# EAGLE design 808-Maraca (EAGLE 7.1.0)
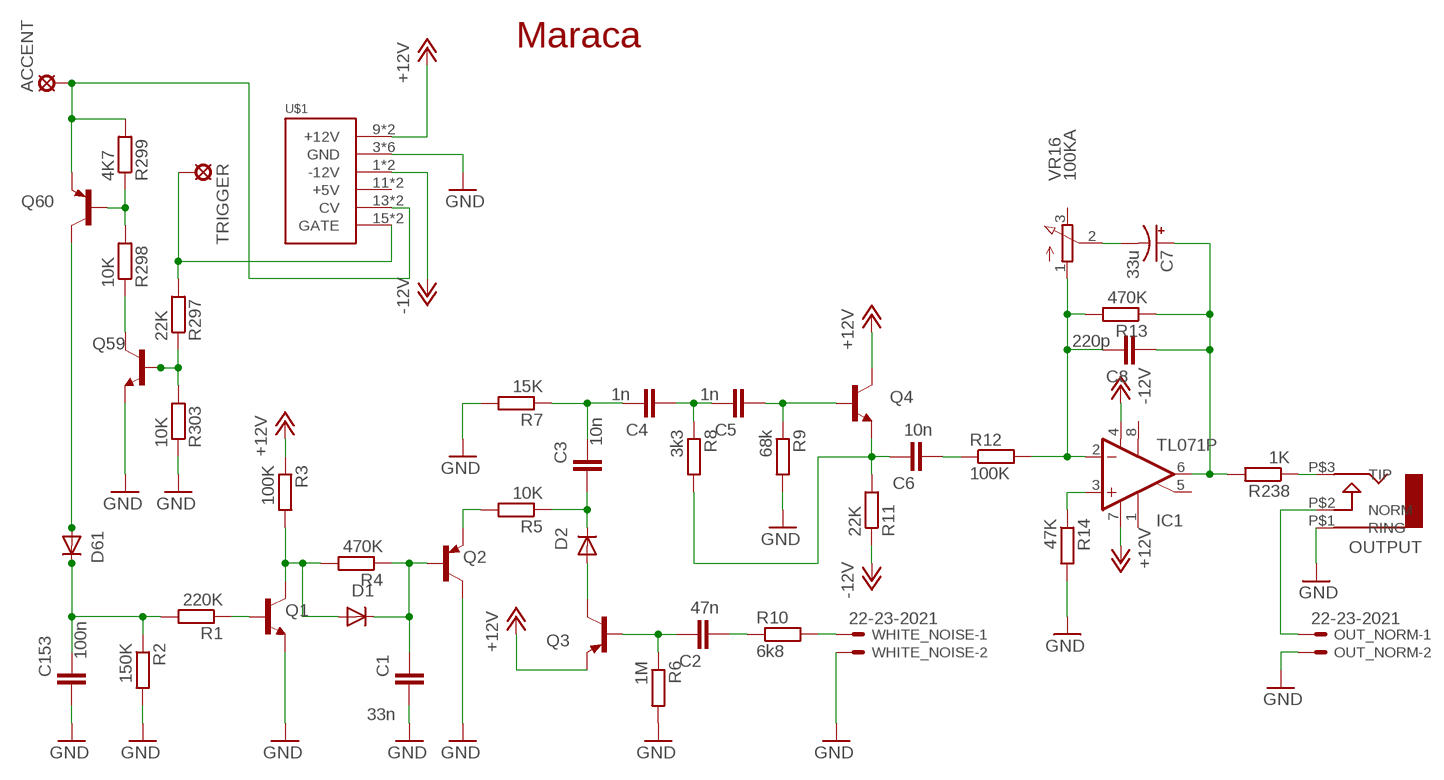
[diagram p0: schematic, sheet 1]

## Parts
ACCENT  LSP11  [LSP11]
C1  33n  C-EU025-025X050  [C025-025X050]
C2  47n  C-EU025-025X050  [C025-025X050]
C3  10n  C-EU025-025X050  [C025-025X050]
C4  1n  C-EU025-025X050  [C025-025X050]
C5  1n  C-EU050-024X044  [C050-024X044]
C6  10n  C-EU025-025X050  [C025-025X050]
C7  33u  CPOL-USB45181A  [B45181A]
C8  220p  C-EU050-024X044  [C050-024X044]
C153  100n  C-EU025-025X050  [C025-025X050]
D1  1N4148DO35-10  [DO35-10]
D2  1N4148DO35-10  [DO35-10]
D61  1N4148DO35-10  [DO35-10]
IC1  TL071P  [DIL08]
OUT_NORM  22-23-2021  [22-23-2021]
OUTPUT  AUDIO-JACK  [ERTHENVAR-JACK-90DEG]
Q1  2N3904  [TO92]
Q2  2N3906  [TO92]
Q3  2N3906  [TO92]
Q4  2N3904  [TO92]
Q59  2N3904  [TO92]
Q60  2N3906  [TO92]
R1  220K  R-EU_0207/7  [0207/7]
R2  150K  R-EU_0207/7  [0207/7]
R3  100K  R-EU_0207/7  [0207/7]
R4  470K  R-EU_0207/7  [0207/7]
R5  10K  R-EU_0207/5V  [0207/5V]
R6  1M  R-EU_0207/5V  [0207/5V]
R7  15K  R-EU_0207/5V  [0207/5V]
R8  3k3  R-EU_0207/5V  [0207/5V]
R9  68k  R-EU_0207/7  [0207/7]
R10  6k8  R-EU_0207/5V  [0207/5V]
R11  22K  R-EU_0309/10  [0309/10]
R12  100K  R-EU_0207/5V  [0207/5V]
R13  470K  R-EU_0207/7  [0207/7]
R14  47K  R-EU_0207/7  [0207/7]
R238  1K  R-EU_0207/5V  [0207/5V]
R297  22K  R-EU_0207/5V  [0207/5V]
R298  10K  R-EU_0207/5V  [0207/5V]
R299  4K7  R-EU_0207/5V  [0207/5V]
R303  10K  R-EU_0207/5V  [0207/5V]
TRIGGER  LSP11  [LSP11]
U$1  POWER  [POWER_16]
VR16  100KA  3RP/1610N  [3RP/1610N]
WHITE_NOISE  22-23-2021  [22-23-2021]

## Nets
+12V: IC1.7(V+) Q3.3(E) Q4.1(C) R3.1 U$1.9(+12V) U$1.10(+12V)
-12V: IC1.4(V-) R11.1 U$1.1(-12V) U$1.2(-12V)
GND [GND]: C1.1 C153.1 OUT_NORM.2 OUTPUT.P$1(RING) Q1.3(E) Q2.1(C) Q59.3(E) R2.2 R6.2 R7.2 R9.2 R14.2 R303.1 U$1.3(GND) U$1.4(GND) U$1.5(GND) U$1.6(GND) U$1.7(GND) U$1.8(GND) WHITE_NOISE.2
LT_LC_OUT: OUTPUT.P$3(TIP) R238.1
N$1: Q60.2(B) R298.2 R299.1
N$2: Q1.2(B) R1.1
N$3: D1.A Q1.1(C) R3.2 R4.2
N$4: C1.2 D1.C Q2.2(B) R4.1
N$5: OUT_NORM.1 OUTPUT.P$2(NORM)
N$6: R10.2 WHITE_NOISE.1
N$7: Q2.3(E) R5.2
N$8: C7.+ C8.1 IC1.6(OUT) R13.1 R238.2
N$9: C3.1 D2.C R5.1
N$10: D2.A Q3.1(C)
N$11: C2.2 Q3.2(B) R6.1
N$12: C3.2 C4.2 R7.1
N$13: C4.1 C5.2 R8.1
N$14: C2.1 R10.1
N$15: C5.1 Q4.2(B) R9.1
N$16: C6.2 Q4.3(E) R8.2 R11.2
N$17: C8.2 IC1.2(-IN) R12.2 R13.2 VR16.1(A)
N$18: C6.1 R12.1
N$19: C7.- VR16.2(S)
N$20: R297.2 TRIGGER.MP U$1.15(GATE) U$1.16(GATE)
N$22: IC1.3(+IN) R14.1
N$318: Q59.2(B) R297.1 R303.2
N$319: Q59.1(C) R298.1
N$324: C153.2 D61.C R1.2 R2.1
N$357: D61.A Q60.1(C)
TRIG: ACCENT.MP Q60.3(E) R299.2 U$1.13(CV) U$1.14(CV)
Unconnected: IC1.1(ON1) IC1.5(ON2) IC1.8(OPT) U$1.11(+5V) U$1.12(+5V) VR16.3(E)

## Notes on the sheet
- Maraca

## Library data of the parts
ACCENT TRIGGER = solpad:LSP11: SOLDER PAD drill 1.1 mm
C1-C6 C8 C153 = TR808clone:C-EU: CAPACITOR, European symbol Pitch 3mm
C7 = rcl:CPOL-US: POLARIZED CAPACITOR, American symbol
D1 D2 D61 = TR808clone:1N4148: DIODE high speed (Philips)
IC1 = linear:TL071: OP AMP
OUT_NORM WHITE_NOISE = con-molex:22-23-2021: .100" (2.54mm) Center Header - 2 Pin; MF: MOLEX; MPN: 22-23-2021; OC_FARNELL: 1462926; OC_NEWARK: 25C3832
OUTPUT = erthenvar:AUDIO-JACK: Switching Mono 3.5mm Audio Jack from Erthenvar.
Q1 Q4 Q59 = 808_lt:2N3904: NPN Transistor
Q2 Q3 Q60 = 808_lt:2N3906: PNP Transistor
R1-R14 R238 R297-R299 R303 = TR808clone:R-EU_: RESISTOR, European symbol
U$1 = eurorack:POWER
VR16 = pot:3RP/1610N: 16mm Potentiometer one level Source: http://www.alphapotentiometers.net/html/16mm_pot_2.html

## Net classes
0 default: width 0.635 mm, drill 0.254 mm, clearance 0.254 mm
1 GND: width 1.016 mm, drill 1.016 mm, clearance 0.508 mm
3 special: width 0.635 mm, drill 0.254 mm, clearance 0.254 mm

## Board
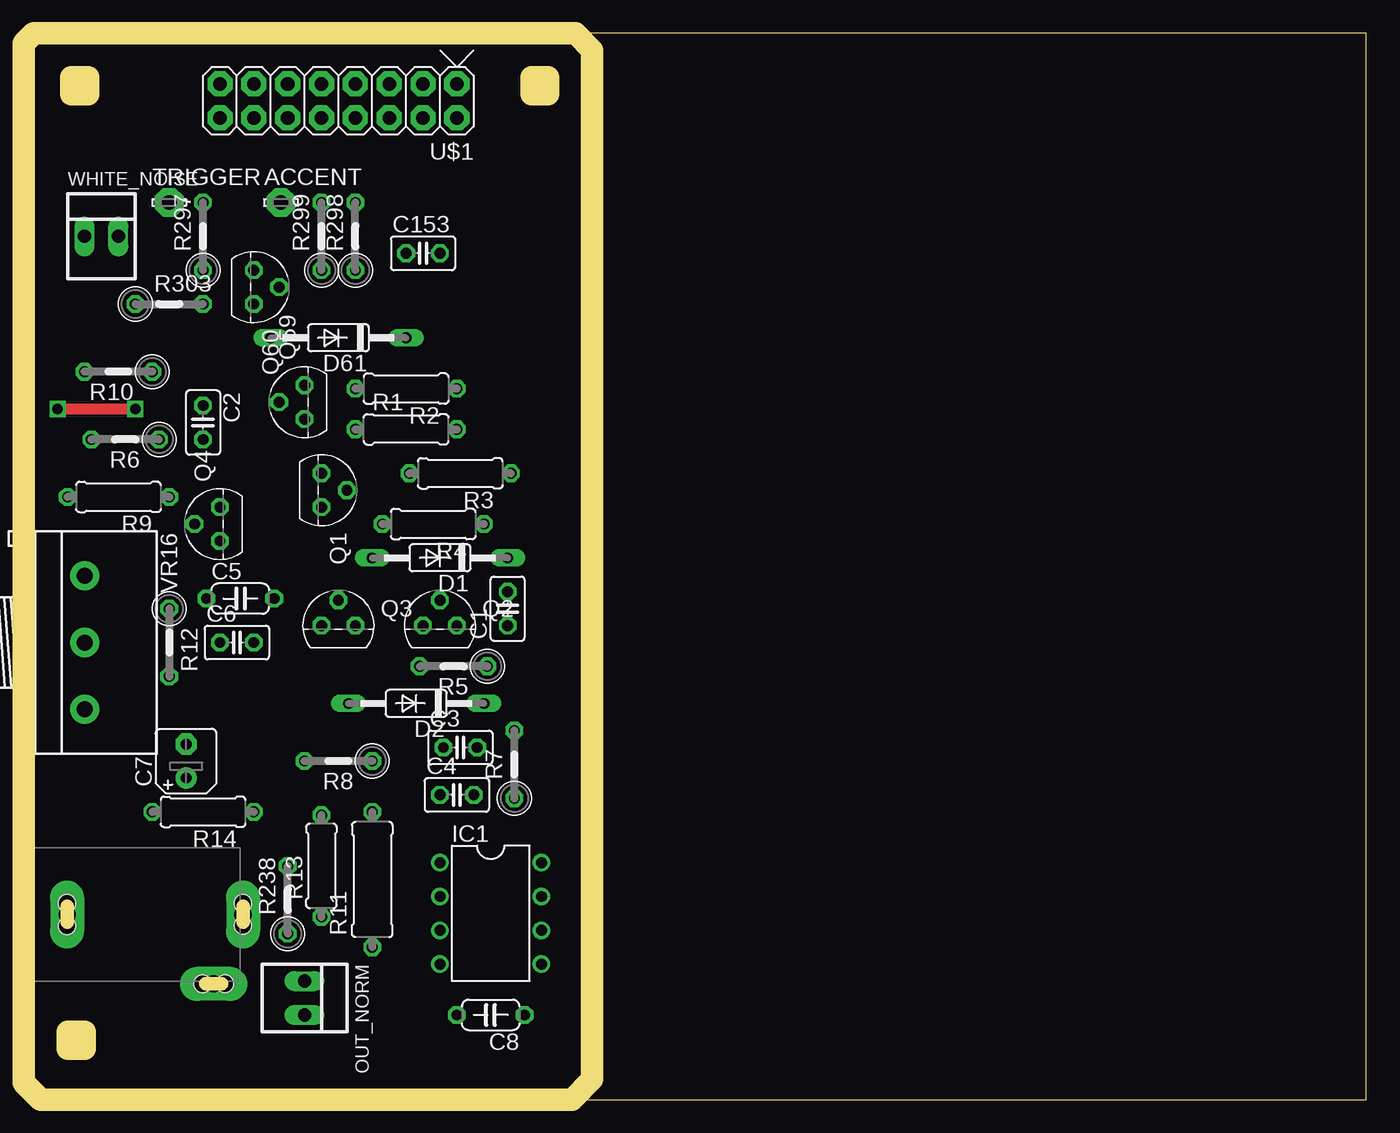
[diagram p1: board, top side]
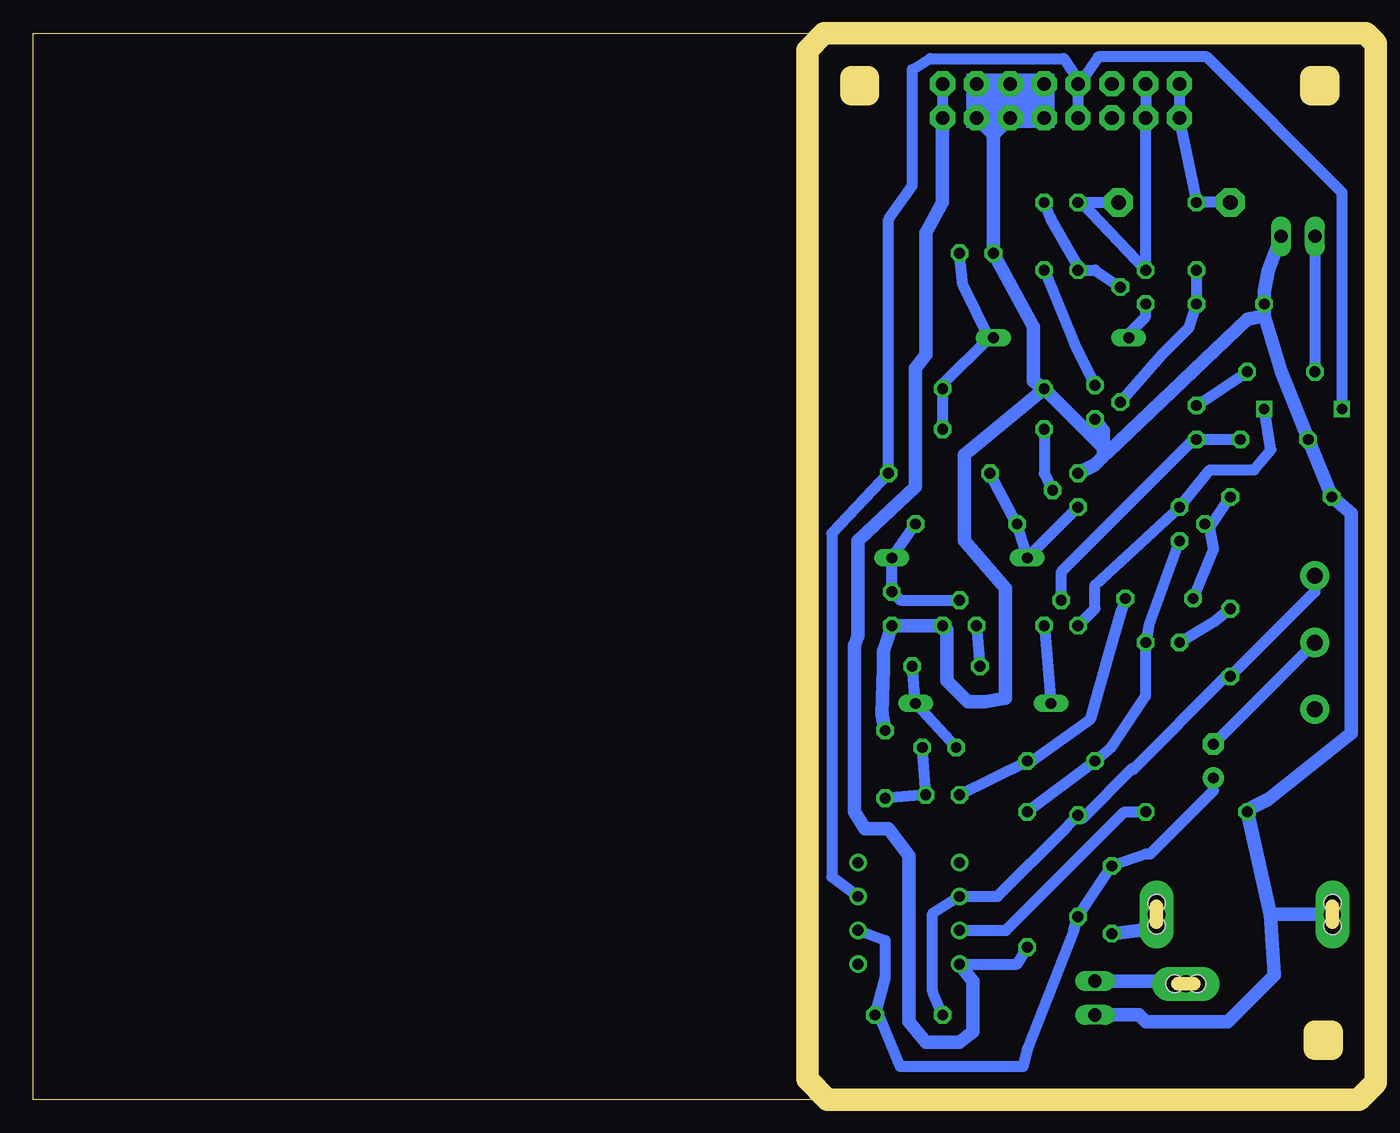
[diagram p2: board, bottom side, seen from below]

Size 100 x 80 mm. Coordinates in mm from the lower left corner, seen from the top.
Outline: 0,0 100,0 100,80 0,80 0,0
Copper layers (1*16): Top 0.035mm / dielectric 1.5mm / Bottom 0.035mm
Design rules "default *": minimum track width 32mil, minimum drill 31mil, track to track 18mil, track to pad 18mil, pad to pad 18mil, via to via 18mil, smd to smd 8mil, copper to edge 0mil, drill to drill 18mil, minimum pad ring 10mil, minimum via ring 8mil, stop-mask expansion 4mil, vias tented up to drill 0mil, thermal gap 10mil
Milling: 20 lines

### Footprints (pad centres in the part's own frame; a part is rotated, then mirrored left to right if it is on the bottom)
LSP11 = drill 1.118 pad 2.159 octagon: MP 0,0
C025-025X050 = drill 0.813 octagon: 1 -1.27,0; 2 1.27,0
C050-024X044 = drill 0.813 octagon: 1 -2.54,0; 2 2.54,0
B45181A = drill 0.813 pad 1.6: + -1.27,0 | drill 0.813 pad 1.6 octagon: - 1.27,0
DO35-10 = drill 0.813 long: A 5.08,0; C -5.08,0
DIL08 = drill 0.813 pad 1.27: 1 -3.81,-3.81; 2 -1.27,-3.81; 3 1.27,-3.81; 4 3.81,-3.81; 5 3.81,3.81; 6 1.27,3.81; 7 -1.27,3.81; 8 -3.81,3.81
22-23-2021 = drill 1 long: 1 -1.27,0; 2 1.27,0
ERTHENVAR-JACK-90DEG = drill 1.3 pad 2.54 long: P$1 5,-2.5; P$2 -0.2,-13.5; P$3 5,-15.7 | hole 1.3: 5.842,-2.489; 4.14,-2.489; -0.203,-12.649; -0.203,-14.351; 5.842,-15.697; 4.166,-15.697
TO92 = drill 0.813 octagon: 1 1.27,0; 2 0,1.905; 3 -1.27,0
0207/7 = drill 0.813 octagon: 1 -3.81,0; 2 3.81,0
0207/5V = drill 0.813 octagon: 1 -2.54,0; 2 2.54,0
0309/10 = drill 0.813 octagon: 1 -5.08,0; 2 5.08,0
POWER_16 = drill 1.016 pad 1.88 octagon: 1 -6.35,-1.27; 2 -6.35,1.27; 3 -3.81,-1.27; 4 -3.81,1.27; 5 -1.27,-1.27; 6 -1.27,1.27; 7 1.27,-1.27; 8 1.27,1.27; 9 3.81,-1.27; 10 3.81,1.27; 11 6.35,-1.27; 12 6.35,1.27; 13 8.89,-1.27; 14 8.89,1.27; 15 11.43,-1.27; 16 11.43,1.27
3RP/1610N = drill 1.2 pad 2.184: 1 -5,0; 2 0,0; 3 5,0

### Placement (x,y rotation side)
ACCENT  18.54,67.31 0 top
C1  35.56,36.83 90 top
C2  12.7,50.8 270 top
C3  32,26.42 0 top
C4  31.75,22.86 0 top
C5  15.49,37.59 0 top
C6  15.24,34.29 0 top
C7  11.43,25.4 90 top
C8  34.29,6.35 180 top
C153  29.21,63.5 0 top
D1  30.48,40.64 180 top
D2  28.7,29.72 180 top
D61  22.86,57.15 180 top
IC1  34.29,13.97 270 top
OUT_NORM  20.32,7.62 270 top
OUTPUT  0,8.89 90 top
Q1  21.59,45.72 270 top
Q2  30.48,35.56 0 top
Q3  22.86,35.56 0 top
Q4  13.97,43.18 90 top
Q59  20.32,52.32 90 top
Q60  16.51,60.96 270 top
R1  27.94,50.29 0 top
R2  27.94,53.34 180 top
R3  32,46.99 180 top
R4  29.97,43.18 180 top
R5  31.5,32.51 180 top
R6  6.86,49.53 180 top
R7  36.07,25.15 90 top
R8  22.86,25.4 180 top
R9  6.35,45.21 180 top
R10  6.35,54.61 180 top
R11  25.4,16.51 90 top
R12  10.16,34.29 270 top
R13  21.59,17.53 90 top
R14  12.7,21.59 180 top
R238  19.05,14.99 90 top
R297  12.7,64.77 90 top
R298  24.13,64.77 90 top
R299  21.59,64.77 90 top
R303  10.16,59.69 0 top
TRIGGER  10.16,67.31 0 top
U$1  25.4,74.93 180 top
VR16  3.81,34.29 270 top
WHITE_NOISE  5.08,64.77 0 top

### Tracks (layer width: path | path; a pad name or v marks a point on that pad's centre or on a via)
+12V  (via drill 0.8)
  Top 0.813: v1.78,51.82 v7.62,51.82
  Bottom 0.813: U$1.10 U$1.9 21.59,76.52 | IC1.7 40.07,16.7 40.07,42.48 R3.1 35.81,66.04 34.04,68.58 34.04,77.28 32.7,78.11 22.67,78.11 21.59,76.52 | Q3.3 20.32,36.83 20.32,38.61 Q4.1 11.68,47.24 8.38,47.24 7.11,48.77 v7.62,51.82 | v1.78,51.82 1.78,68.07 11.94,78.23 20.07,78.23 21.27,76.52 21.59,76.52
-12V
  Bottom 0.813: R11.1 26.16,10.16 IC1.4 | U$1.1 U$1.2
  Bottom 1.016: U$1.2 31.75,67.31 33.02,65.02 33.02,55.88 33.78,54.86 33.78,45.97 38.1,41.91 38.1,34.8 38.35,34.04 38.35,21.59 37.59,20.32 35.81,20.32 34.29,18.29 34.29,5.84 33.02,4.32 30.48,4.32 29.46,5.08 29.46,8.89 IC1.4
GND
  Bottom 1.016: 7.14,13.92 6.86,9.34 10.35,5.84 16.51,5.84 17.02,6.35 OUT_NORM.2 | 7.14,13.92 R14.2 8.57,21.91 7.3,22.54 1.08,27.5 1.08,44.01 R9.2 R6.2 6.35,54.61 7.62,58.8 | 7.62,58.8 R303.1 7.62,60.64 7.3,62.23 WHITE_NOISE.2 | R7.2 36.32,28.96 36.2,32.38 36.2,33.66 C1.1 Q2.1 31.43,35.24 31.43,31.43 29.84,29.84 28.57,29.84 27.05,30.1 27.05,38.35 30.1,41.91 30.1,48.39 R2.2 | Q1.3 20.32,47.62 19.68,48.26 19.68,48.58 | 19.68,49.21 19.68,50.16 Q59.3 | 19.68,49.21 19.68,48.58 | R2.2 20,49.21 19.68,49.21 | 27.94,72.39 C153.1 24.96,57.98 24.96,53.91 R2.2 | 27.94,72.39 U$1.6 U$1.8 U$1.7 U$1.5 U$1.3 | 27.94,72.39 U$1.4 | 7.62,58.8 8.89,58.55 19.37,48.58 19.68,48.58 | OUTPUT.P$1 7.11,13.89 7.14,13.92
LT_LC_OUT
  Bottom 1.016: R238.1 16.89,12.7 OUTPUT.P$3
N$1
  Bottom 0.813: Q60.2 20.32,62.23 R299.1 21.59,62.55 23.62,66.1 R298.2
N$2
  Bottom 0.813: Q1.2 24.13,46.99 R1.1
N$3
  Bottom 0.813: Q1.1 D1.A R4.2 R3.2
N$4
  Bottom 0.813: Q2.2 34.92,37.47 C1.2 D1.C R4.1
N$5
  Bottom 1.016: OUT_NORM.1 13.7,8.89 OUTPUT.P$2
N$6
  Bottom 0.813: WHITE_NOISE.1 R10.2
N$7
  Bottom 0.813: Q2.3 R5.2
N$8
  Bottom 0.813: IC1.6 36.07,11.94 36.07,9.14 C8.1 36.51,6.35 34.92,2.48 25.72,2.48 25.4,3.81 21.91,12.7 R13.1 R238.2 16.51,18.41 16.19,18.41 11.43,23.18 C7.+
N$9
  Bottom 0.813: C3.1 D2.C R5.1
N$10
  Bottom 0.813: Q3.1 D2.A
N$11
  Bottom 0.813: R6.1 C2.2 12.7,49.72 22.86,39.56 Q3.2
N$12
  Bottom 0.813: C3.2 C4.2 R7.1
N$13
  Bottom 0.813: C4.1 R8.1 25.08,25.4 20.64,28.57 19.11,33.91 18.29,36.77 C5.2
N$14
  Bottom 0.813: C2.1 R10.1
N$15
  Bottom 0.813: C5.1 11.43,41.27 11.75,42.86 | 11.75,42.86 R9.1 | 11.75,42.86 Q4.2
N$16
  Bottom 0.813: Q4.3 16.26,35.62 C6.2 16.51,30.29 19.05,26.48 R8.2 R11.2
N$17
  Bottom 0.813: VR16.1 3.81,38.1 R12.2 10.48,31.75 17.46,24.77 17.46,24.89 21.27,21.08 R13.2 22.54,20.32 27.62,15.24 IC1.2 32.51,13.97 32.51,8.13 C8.2
N$18
  Bottom 0.813: R12.1 11.43,35.81 C6.1
N$19
  Bottom 0.813: VR16.2 C7.-
N$20
  Bottom 0.813: U$1.15 U$1.16 12.7,67.63 R297.2 TRIGGER.MP
N$22
  Bottom 0.813: R14.1 18.1,21.59 26.99,12.7 IC1.3
N$318
  Bottom 0.813: R297.1 R303.2 13.27,57.91 15.3,55.88 Q59.2
N$319
  Bottom 0.813: Q59.1 21.84,56.64 R298.1
N$324
  Bottom 0.813: R1.2 R2.1 31.75,53.66 28.29,57.12 | 28.29,57.12 28.26,57.15 D61.C | C153.2 30.23,61.09 28.29,57.12
N$357
  Bottom 0.813: Q60.1 16.51,58.74 17.78,57.47 D61.A
TRIG
  Bottom 0.813: U$1.13 U$1.14 Q60.3 21.34,67.31 | R299.2 21.34,67.31 | 21.34,67.31 ACCENT.MP
(copper drawn outside any net)
  shapes: Bottom area x1